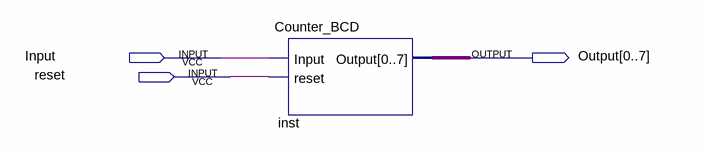
[diagram p0: schematic sheet]
// Quartus schematic compt3.bdf as structural Verilog: 1 symbols, 3 pins
module compt3 (
  input  Input,
  input  reset,
  output [0:7] Output
);

  Counter_BCD inst (.Input(Input), .reset(reset), .Output(Output));
endmodule
